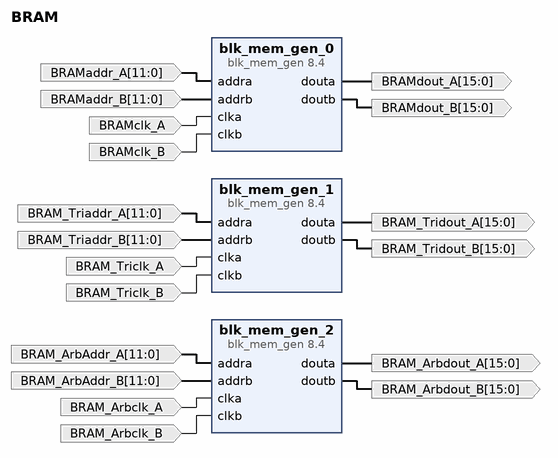
[diagram p0: block diagram of the top level]
# Vivado block design BRAM, xc7z007sclg400-1, Vivado 2022.2
create_bd_design BRAM

create_bd_port -dir I -from 11 -to 0 BRAMaddr_A
create_bd_port -dir I -type clk BRAMclk_A
create_bd_port -dir O -from 15 -to 0 BRAMdout_A
create_bd_port -dir I -from 11 -to 0 BRAMaddr_B
create_bd_port -dir I -type clk BRAMclk_B
create_bd_port -dir O -from 15 -to 0 BRAMdout_B
create_bd_port -dir I -from 11 -to 0 BRAM_Triaddr_A
create_bd_port -dir I -type clk BRAM_Triclk_A
create_bd_port -dir O -from 15 -to 0 BRAM_Tridout_A
create_bd_port -dir O -from 15 -to 0 BRAM_Tridout_B
create_bd_port -dir I -type clk BRAM_Triclk_B
create_bd_port -dir I -from 11 -to 0 BRAM_Triaddr_B
create_bd_port -dir I -from 11 -to 0 BRAM_ArbAddr_A
create_bd_port -dir I -type clk BRAM_Arbclk_A
create_bd_port -dir O -from 15 -to 0 BRAM_Arbdout_A
create_bd_port -dir I -from 11 -to 0 BRAM_ArbAddr_B
create_bd_port -dir I -type clk BRAM_Arbclk_B
create_bd_port -dir O -from 15 -to 0 BRAM_Arbdout_B

create_bd_cell -type ip -vlnv xilinx.com:ip:blk_mem_gen:8.4 blk_mem_gen_0
set_property -dict [list \
  CONFIG.Coe_File ../../../../src/coefficient_file.coe \
  CONFIG.Enable_A Always_Enabled \
  CONFIG.Enable_B Always_Enabled \
  CONFIG.Load_Init_File true \
  CONFIG.Memory_Type Dual_Port_ROM \
  CONFIG.Write_Depth_A 4096 \
  CONFIG.Write_Width_A 16 \
  CONFIG.use_bram_block Stand_Alone \
] [get_bd_cells blk_mem_gen_0]
create_bd_cell -type ip -vlnv xilinx.com:ip:blk_mem_gen:8.4 blk_mem_gen_1
set_property -dict [list \
  CONFIG.Coe_File ../../../../src/output.coe \
  CONFIG.Enable_A Always_Enabled \
  CONFIG.Enable_B Always_Enabled \
  CONFIG.Load_Init_File true \
  CONFIG.Memory_Type Dual_Port_ROM \
  CONFIG.Write_Depth_A 4096 \
  CONFIG.Write_Width_A 16 \
  CONFIG.use_bram_block Stand_Alone \
] [get_bd_cells blk_mem_gen_1]
create_bd_cell -type ip -vlnv xilinx.com:ip:blk_mem_gen:8.4 blk_mem_gen_2
set_property -dict [list \
  CONFIG.Coe_File ../../../../src/Tes.coe \
  CONFIG.Enable_A Always_Enabled \
  CONFIG.Enable_B Always_Enabled \
  CONFIG.Load_Init_File true \
  CONFIG.Memory_Type Dual_Port_ROM \
  CONFIG.Write_Depth_A 4096 \
  CONFIG.Write_Width_A 16 \
  CONFIG.use_bram_block Stand_Alone \
] [get_bd_cells blk_mem_gen_2]

# ---- connections ----

connect_bd_net -net addra_0_1 [get_bd_ports BRAMaddr_A] [get_bd_pins blk_mem_gen_0/addra]
connect_bd_net -net addra_0_2 [get_bd_ports BRAM_Triaddr_A] [get_bd_pins blk_mem_gen_1/addra]
connect_bd_net -net addra_0_3 [get_bd_ports BRAM_ArbAddr_A] [get_bd_pins blk_mem_gen_2/addra]
connect_bd_net -net addrb_0_1 [get_bd_ports BRAMaddr_B] [get_bd_pins blk_mem_gen_0/addrb]
connect_bd_net -net addrb_0_2 [get_bd_ports BRAM_Triaddr_B] [get_bd_pins blk_mem_gen_1/addrb]
connect_bd_net -net addrb_0_3 [get_bd_ports BRAM_ArbAddr_B] [get_bd_pins blk_mem_gen_2/addrb]
connect_bd_net [get_bd_pins blk_mem_gen_0/douta] [get_bd_ports BRAMdout_A]
connect_bd_net [get_bd_pins blk_mem_gen_0/doutb] [get_bd_ports BRAMdout_B]
connect_bd_net [get_bd_pins blk_mem_gen_1/douta] [get_bd_ports BRAM_Tridout_A]
connect_bd_net [get_bd_pins blk_mem_gen_1/doutb] [get_bd_ports BRAM_Tridout_B]
connect_bd_net [get_bd_pins blk_mem_gen_2/douta] [get_bd_ports BRAM_Arbdout_A]
connect_bd_net [get_bd_pins blk_mem_gen_2/doutb] [get_bd_ports BRAM_Arbdout_B]
connect_bd_net -net clka_0_1 [get_bd_ports BRAMclk_A] [get_bd_pins blk_mem_gen_0/clka]
connect_bd_net -net clka_0_2 [get_bd_ports BRAM_Triclk_A] [get_bd_pins blk_mem_gen_1/clka]
connect_bd_net -net clka_0_3 [get_bd_ports BRAM_Arbclk_A] [get_bd_pins blk_mem_gen_2/clka]
connect_bd_net -net clkb_0_1 [get_bd_ports BRAMclk_B] [get_bd_pins blk_mem_gen_0/clkb]
connect_bd_net -net clkb_0_2 [get_bd_ports BRAM_Triclk_B] [get_bd_pins blk_mem_gen_1/clkb]
connect_bd_net -net clkb_0_3 [get_bd_ports BRAM_Arbclk_B] [get_bd_pins blk_mem_gen_2/clkb]

validate_bd_design
save_bd_design
